# EAGLE schematic Robotics_Cape (EAGLE 7.7.0)
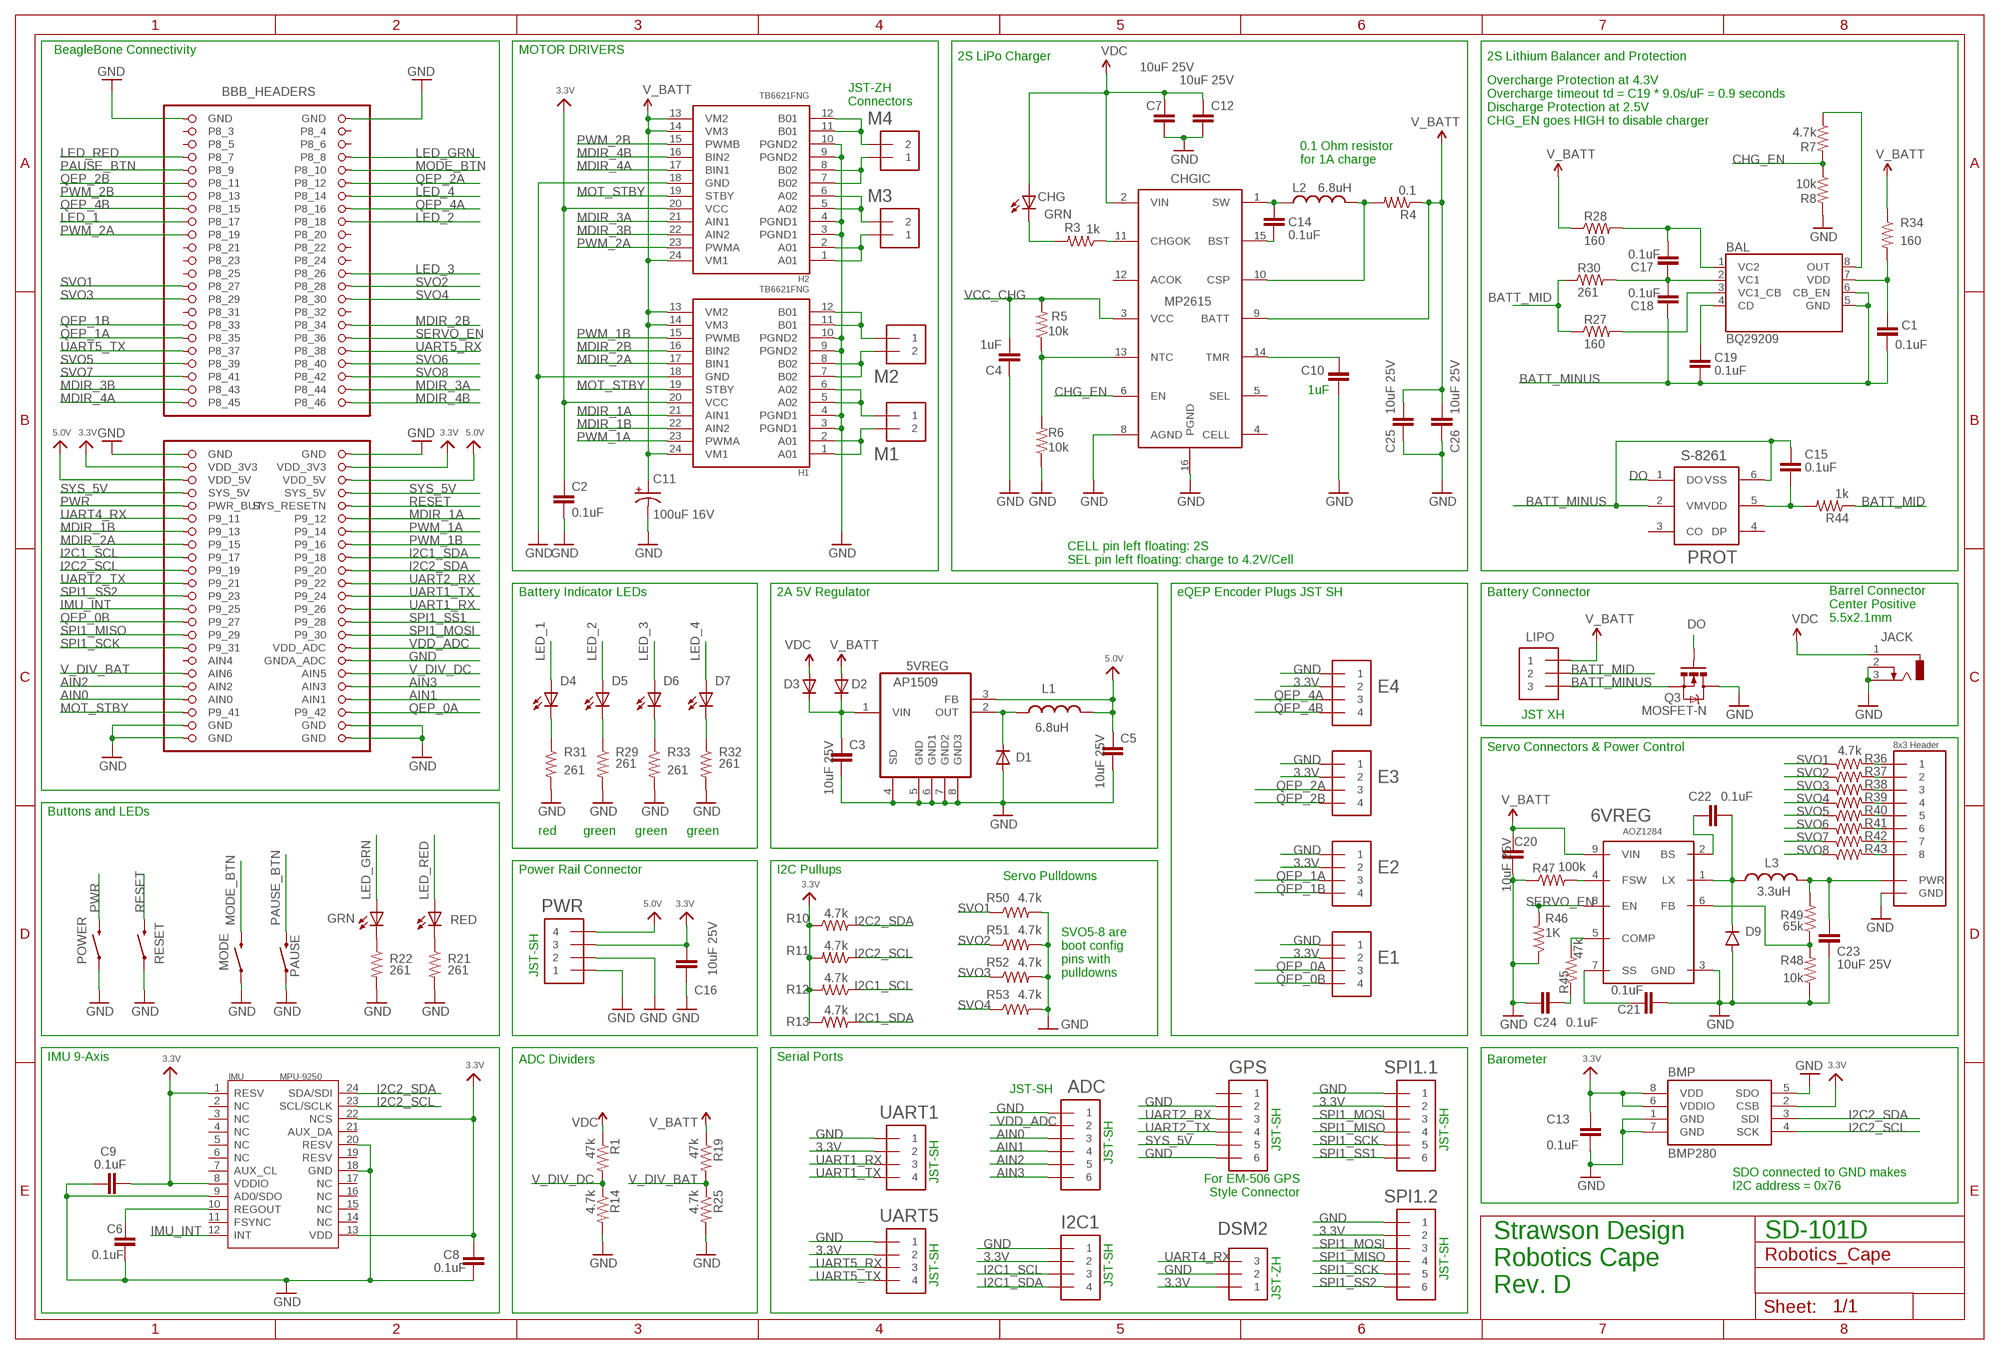
[diagram p0: schematic, sheet 1]

## Parts
5VREG  AP1509SOIC-8-TIGHT  [SO08-TIGHT]
6VREG  AOZ1284  [SO08-EXPOSED]
ADC  JST_SH_6  [JST_SH_6]
BAL  BQ29209  [8-SON_3X3MM]
BBB_HEADERS  BEAGLEBONE_OUTLINE  [BEAGLEBONE_SHIELD]
BMP  BMP280  [BMP280]
C1  0.1uF  CAP0402-CAP  [0402-CAP]
C2  0.1uF  CAP0402-CAP  [0402-CAP]
C3  10uF 25V  CAP0805  [0805]
C4  1uF  CAP0402-CAP  [0402-CAP]
C5  10uF 25V  CAP0805  [0805]
C6  0.1uF  CAP0402-CAP  [0402-CAP]
C7  10uF 25V  CAP0805  [0805]
C8  0.1uF  CAP0402-CAP  [0402-CAP]
C9  0.1uF  CAP0402-CAP  [0402-CAP]
C10  1uF  CAP0402-CAP  [0402-CAP]
C11  100uF 16V  CPOL-USD  [PANASONIC_D]
C12  10uF 25V  CAP0805  [0805]
C13  0.1uF  CAP0402-CAP  [0402-CAP]
C14  0.1uF  CAP0402-CAP  [0402-CAP]
C15  0.1uF  CAP0402-CAP  [0402-CAP]
C16  10uF 25V  CAP0805  [0805]
C17  0.1uF  CAP0402-CAP  [0402-CAP]
C18  0.1uF  CAP0402-CAP  [0402-CAP]
C19  0.1uF  CAP0402-CAP  [0402-CAP]
C20  10uF 25V  CAP0805  [0805]
C21  0.1uF  CAP0402-CAP  [0402-CAP]
C22  0.1uF  CAP0402-CAP  [0402-CAP]
C23  10uF 25V  CAP0805  [0805]
C24  0.1uF  CAP0402-CAP  [0402-CAP]
C25  10uF 25V  CAP0805  [0805]
C26  10uF 25V  CAP0805  [0805]
CHG  GRN  LED0603  [LED-0603]
CHGIC  MP2615  [MP2615]
D1  DIODESOD-123  [SOD-123]
D2  DIODESOD-123  [SOD-123]
D3  DIODESOD-123  [SOD-123]
D4  RED  LED0603  [LED-0603]
D5  GREEN  LED0603  [LED-0603]
D6  GREEN  LED0603  [LED-0603]
D7  GREEN  LED0603  [LED-0603]
D9  DIODEDO214AA  [DO-214AA]
DSM2  JST_ZH_3  [JST_ZH_3]
E1  JST_SH_4  [JST_SH_4_SMD]
E2  JST_SH_4  [JST_SH_4_SMD]
E3  JST_SH_4  [JST_SH_4_SMD]
E4  JST_SH_4  [JST_SH_4_SMD]
GPS  JST_SH_6  [JST_SH_6]
GRN  GRN  LED0603  [LED-0603]
H1  TB6621FNG  [SSOP24]
H2  TB6621FNG  [SSOP24]
I2C1  JST_SH_4  [JST_SH_4_SMD]
IMU  MPU-9250  [QFN24G-0.4-3X3MM]
JACK  5.5x2.1mm  DCJ0303  [DCJ0303]
L1  6.8uH  INDUCTORTAIYO_NR-S  [TAIYO_NRS]
L2  6.8uH  INDUCTORTAIYO_NR-S  [TAIYO_NRS]
L3  3.3uH  INDUCTOR  [8X8MM_INDUCTOR]
LIPO  JST_XH_3-PIN  [JST_XH_3-PIN]
M1  JST_ZH_2  [JST_ZH_2]
M2  JST_ZH_2  [JST_ZH_2]
M3  JST_ZH_2  [JST_ZH_2]
M4  JST_ZH_2  [JST_ZH_2]
MODE  SWITCH-MOMENTARY-2-SMD-1101NE  [TACTILE-SWITCH-1101NE]
PAUSE  SWITCH-MOMENTARY-2-SMD-1101NE  [TACTILE-SWITCH-1101NE]
POWER  SWITCH-MOMENTARY-2-SMD-1101NE  [TACTILE-SWITCH-1101NE]
PROT  S-8261  [SOT-236]
PWR  JST_SH_4  [JST_SH_4_SMD]
Q3  MOSFET-N  MOSFET-NCHANNEL  [SO08-TIGHT]
R1  47k  RESISTOR0402-RES  [0402-RES]
R3  1k  RESISTOR0402-RES  [0402-RES]
R4  0.1  RESISTOR0603  [0603-RES]
R5  10k  RESISTOR0402-RES  [0402-RES]
R6  10k  RESISTOR0402-RES  [0402-RES]
R7  4.7k  RESISTOR0402-RES  [0402-RES]
R8  10k  RESISTOR0402-RES  [0402-RES]
R10  4.7k  RESISTOR0402-RES  [0402-RES]
R11  4.7k  RESISTOR0402-RES  [0402-RES]
R12  4.7k  RESISTOR0402-RES  [0402-RES]
R13  4.7k  RESISTOR0402-RES  [0402-RES]
R14  4.7k  RESISTOR0402-RES  [0402-RES]
R19  47k  RESISTOR0402-RES  [0402-RES]
R21  261  RESISTOR0402-RES  [0402-RES]
R22  261  RESISTOR0402-RES  [0402-RES]
R25  4.7k  RESISTOR0402-RES  [0402-RES]
R27  160  RESISTOR0402-RES  [0402-RES]
R28  160  RESISTOR0402-RES  [0402-RES]
R29  261  RESISTOR0402-RES  [0402-RES]
R30  261  RESISTOR0402-RES  [0402-RES]
R31  261  RESISTOR0402-RES  [0402-RES]
R32  261  RESISTOR0402-RES  [0402-RES]
R33  261  RESISTOR0402-RES  [0402-RES]
R34  160  RESISTOR0402-RES  [0402-RES]
R36  4.7k  RESISTOR0402-RES  [0402-RES]
R37  4.7k  RESISTOR0402-RES  [0402-RES]
R38  4.7k  RESISTOR0402-RES  [0402-RES]
R39  4.7k  RESISTOR0402-RES  [0402-RES]
R40  4.7k  RESISTOR0402-RES  [0402-RES]
R41  4.7k  RESISTOR0402-RES  [0402-RES]
R42  4.7k  RESISTOR0402-RES  [0402-RES]
R43  4.7k  RESISTOR0402-RES  [0402-RES]
R44  1k  RESISTOR0402-RES  [0402-RES]
R45  47k  RESISTOR0402-RES  [0402-RES]
R46  1K  RESISTOR0402-RES  [0402-RES]
R47  100k  RESISTOR0402-RES  [0402-RES]
R48  10k  RESISTOR0402-RES  [0402-RES]
R49  65k  RESISTOR0402-RES  [0402-RES]
R50  4.7k  RESISTOR0402-RES  [0402-RES]
R51  4.7k  RESISTOR0402-RES  [0402-RES]
R52  4.7k  RESISTOR0402-RES  [0402-RES]
R53  4.7k  RESISTOR0402-RES  [0402-RES]
RED  RED  LED0603  [LED-0603]
RESET  SWITCH-MOMENTARY-2-SMD-1101NE  [TACTILE-SWITCH-1101NE]
SPI1.1  JST_SH_6  [JST_SH_6]
SPI1.2  JST_SH_6  [JST_SH_6]
U$1  SERVO_HEADERS_8X  [3X8_0.1"_HEADER]
UART1  JST_SH_4  [JST_SH_4_SMD]
UART5  JST_SH_4  [JST_SH_4_SMD]

## Nets
3.3V: BBB_HEADERS.49(VDD_3V3) BBB_HEADERS.50(VDD_3V3) BMP.2(CSB) BMP.6(VDDIO) BMP.8(VDD) C2.2 C8.1 C9.2 C13.1 C16.1 DSM2.P$1 E1.2 E2.2 E3.2 E4.2 H1.20(VCC) H2.20(VCC) I2C1.2 IMU.1(RESV) IMU.8(VDDIO) IMU.13(VDD) IMU.22(NCS) PWR.3 R10.1 R11.2 R12.2 R13.1 SPI1.1.2 SPI1.2.2 UART1.2 UART5.2
5.0V: 5VREG.3(FB) BBB_HEADERS.51(VDD_5V) BBB_HEADERS.52(VDD_5V) C5.1 L1.2 PWR.4
AIN0: ADC.3 BBB_HEADERS.85(AIN0)
AIN1: ADC.4 BBB_HEADERS.86(AIN1)
AIN2: ADC.5 BBB_HEADERS.83(AIN2)
AIN3: ADC.6 BBB_HEADERS.84(AIN3)
BATT_MID: LIPO.P$2 R27.1 R30.1 R44.1
BATT_MINUS: BAL.5(GND) BAL.6(CB_EN) C1.2 C15.1 C18.1 C19.2 LIPO.P$3 PROT.2(VM) PROT.6(VSS) Q3.1(S) Q3.2(S) Q3.3(S)
CHG_EN: CHGIC.6(EN) R7.2 R8.1
CO: BAL.8(OUT) R7.1
DO: PROT.1(DO) Q3.4(G)
GND: 5VREG.4(SD) 5VREG.5(GND) 5VREG.6(GND1) 5VREG.7(GND2) 5VREG.8(GND3) 6VREG.3(GND) ADC.1 BBB_HEADERS.1(GND) BBB_HEADERS.2(GND) BBB_HEADERS.47(GND) BBB_HEADERS.48(GND) BBB_HEADERS.80(GNDA_ADC) BBB_HEADERS.89(GND) BBB_HEADERS.90(GND) BBB_HEADERS.91(GND) BBB_HEADERS.92(GND) BMP.1(GND) BMP.5(SDO) BMP.7(GND) C2.1 C3.2 C4.1 C5.2 C6.2 C7.2 C8.2 C9.1 C10.1 C11.- C12.2 C13.2 C16.2 C20.1 C21.1 C23.1 C24.1 C25.2 C26.2 CHGIC.8(AGND) CHGIC.16(PGND) D1.A D9.A DSM2.P$2 E1.1 E2.1 E3.1 E4.1 GPS.2 GPS.6 H1.3(PGND1) H1.4(PGND1) H1.9(PGND2) H1.10(PGND2) H1.18(GND) H2.3(PGND1) H2.4(PGND1) H2.9(PGND2) H2.10(PGND2) H2.18(GND) I2C1.1 IMU.9(AD0/SDO) IMU.18(GND) IMU.20(RESV) JACK.2 JACK.3 MODE.P$1 PAUSE.P$1 POWER.P$1 PWR.1 PWR.2 Q3.5(D) Q3.6(D) Q3.7(D) Q3.8(D) R6.1 R8.2 R14.2 R21.2 R22.2 R25.2 R29.2 R31.2 R32.2 R33.2 R46.1 R47.1 R48.1 R50.2 R51.2 R52.2 R53.2 RESET.P$1 SPI1.1.1 SPI1.2.1 U$1.P$13(GND) U$1.P$14(GND) U$1.P$15(GND) U$1.P$16(GND) U$1.P$17(GND) U$1.P$18(GND) U$1.P$23(GND) U$1.P$24(GND) UART1.1 UART5.1
I2C1_SCL: BBB_HEADERS.63(P9_17) I2C1.3 R12.1
I2C1_SDA: BBB_HEADERS.64(P9_18) I2C1.4 R13.2
I2C2_SCL: BBB_HEADERS.65(P9_19) BMP.4(SCK) IMU.23(SCL/SCLK) R11.1
I2C2_SDA: BBB_HEADERS.66(P9_20) BMP.3(SDI) IMU.24(SDA/SDI) R10.2
IMU_INT: BBB_HEADERS.71(P9_25) IMU.12(INT)
L3: D6.C R33.1
L4: D7.C R32.1
LED_1: BBB_HEADERS.17(P8_17) D4.A
LED_2: BBB_HEADERS.18(P8_18) D5.A
LED_3: BBB_HEADERS.26(P8_26) D6.A
LED_4: BBB_HEADERS.14(P8_14) D7.A
LED_GRN: BBB_HEADERS.8(P8_8) GRN.A
LED_RED: BBB_HEADERS.7(P8_7) RED.A
MDIR_1A: BBB_HEADERS.58(P9_12) H1.21(AIN1)
MDIR_1B: BBB_HEADERS.59(P9_13) H1.22(AIN2)
MDIR_2A: BBB_HEADERS.61(P9_15) H1.17(BIN1)
MDIR_2B: BBB_HEADERS.34(P8_34) H1.16(BIN2)
MDIR_3A: BBB_HEADERS.44(P8_44) H2.21(AIN1)
MDIR_3B: BBB_HEADERS.43(P8_43) H2.22(AIN2)
MDIR_4A: BBB_HEADERS.45(P8_45) H2.17(BIN1)
MDIR_4B: BBB_HEADERS.46(P8_46) H2.16(BIN2)
MODE_BTN: BBB_HEADERS.10(P8_10) MODE.P$2
MOT1A: H1.1(A01) H1.2(A01) M1.P$2
MOT1B: H1.5(A02) H1.6(A02) M1.P$1
MOT2A: H1.11(B01) H1.12(B01) M2.P$1
MOT2B: H1.7(B02) H1.8(B02) M2.P$2
MOT3A: H2.1(A01) H2.2(A01) M3.P$1
MOT3B: H2.5(A02) H2.6(A02) M3.P$2
MOT4A: H2.11(B01) H2.12(B01) M4.P$2
MOT4B: H2.7(B02) H2.8(B02) M4.P$1
MOT_STBY: BBB_HEADERS.87(P9_41) H1.19(STBY) H2.19(STBY)
N$1: R36.2 U$1.P$1
N$3: GRN.C R22.1
N$4: BAL.2(VC1) C17.1 C18.2 R30.2
N$6: R21.1 RED.C
N$8: BAL.1(VC2) C17.2 R28.2
N$10: 6VREG.7(SS) C21.2
N$11: C15.2 PROT.5(VDD) R44.2
N$14: C6.1 IMU.10(REGOUT)
N$15: C14.1 CHGIC.15(BST)
N$16: 5VREG.2(OUT) D1.C L1.1
N$17: CHG.C R3.2
N$18: CHGIC.11(CHGOK) R3.1
N$24: BAL.4(CD) C19.1
N$25: R37.2 U$1.P$2
N$29: BAL.7(VDD) C1.1 R34.2
N$30: R38.2 U$1.P$3
N$38: R39.2 U$1.P$4
N$48: D5.C R29.1
N$49: D4.C R31.1
N$50: BAL.3(VC1_CB) R27.2
N$51: R40.2 U$1.P$5
N$52: R41.2 U$1.P$6
N$53: 6VREG.2(BS) C22.1
N$54: R42.2 U$1.P$19
N$55: C14.2 CHGIC.1(SW) L2.1
N$56: R43.2 U$1.P$20
N$60: 6VREG.1(LX) C22.2 D9.C L3.1
N$61: 6VREG.4(FSW) R47.2
N$62: C23.2 L3.2 R49.2 U$1.P$7(PWR) U$1.P$8(PWR) U$1.P$9(PWR) U$1.P$10(PWR) U$1.P$11(PWR) U$1.P$12(PWR) U$1.P$21(PWR) U$1.P$22(PWR)
N$63: 6VREG.5(COMP) R45.2
N$65: 6VREG.6(FB) R48.2 R49.1
N$66: C24.2 R45.1
N$67: CHGIC.10(CSP) L2.2 R4.2
N$69: C10.2 CHGIC.14(TMR)
N$71: CHGIC.13(NTC) R5.1 R6.2
N$79: 5VREG.1(VIN) C3.1 D2.C D3.C
PAUSE_BTN: BBB_HEADERS.9(P8_9) PAUSE.P$2
PWM_1A: BBB_HEADERS.60(P9_14) H1.23(PWMA)
PWM_1B: BBB_HEADERS.62(P9_16) H1.15(PWMB)
PWM_2A: BBB_HEADERS.19(P8_19) H2.23(PWMA)
PWM_2B: BBB_HEADERS.13(P8_13) H2.15(PWMB)
PWR: BBB_HEADERS.55(PWR_BUT) POWER.P$2
QEP_0A: BBB_HEADERS.88(P9_42) E1.3
QEP_0B: BBB_HEADERS.73(P9_27) E1.4
QEP_1A: BBB_HEADERS.35(P8_35) E2.3
QEP_1B: BBB_HEADERS.33(P8_33) E2.4
QEP_2A: BBB_HEADERS.12(P8_12) E3.3
QEP_2B: BBB_HEADERS.11(P8_11) E3.4
QEP_4A: BBB_HEADERS.16(P8_16) E4.3
QEP_4B: BBB_HEADERS.15(P8_15) E4.4
RESET: BBB_HEADERS.56(SYS_RESETN) RESET.P$2
SERVO_EN: 6VREG.8(EN) BBB_HEADERS.36(P8_36) R46.2
SPI1_MISO: BBB_HEADERS.75(P9_29) SPI1.1.4 SPI1.2.4
SPI1_MOSI: BBB_HEADERS.76(P9_30) SPI1.1.3 SPI1.2.3
SPI1_SCK: BBB_HEADERS.77(P9_31) SPI1.1.5 SPI1.2.5
SPI1_SS1: BBB_HEADERS.74(P9_28) SPI1.1.6
SPI1_SS2: BBB_HEADERS.69(P9_23) SPI1.2.6
SVO1: BBB_HEADERS.27(P8_27) R36.1 R50.1
SVO2: BBB_HEADERS.28(P8_28) R37.1 R51.1
SVO3: BBB_HEADERS.29(P8_29) R38.1 R52.1
SVO4: BBB_HEADERS.30(P8_30) R39.1 R53.1
SVO5: BBB_HEADERS.39(P8_39) R40.1
SVO6: BBB_HEADERS.40(P8_40) R41.1
SVO7: BBB_HEADERS.41(P8_41) R42.1
SVO8: BBB_HEADERS.42(P8_42) R43.1
SYS_5V: BBB_HEADERS.53(SYS_5V) BBB_HEADERS.54(SYS_5V) GPS.5
UART1_RX: BBB_HEADERS.72(P9_26) UART1.3
UART1_TX: BBB_HEADERS.70(P9_24) UART1.4
UART2_RX: BBB_HEADERS.68(P9_22) GPS.3
UART2_TX: BBB_HEADERS.67(P9_21) GPS.4
UART4_RX: BBB_HEADERS.57(P9_11) DSM2.P$3
UART5_RX: BBB_HEADERS.38(P8_38) UART5.3
UART5_TX: BBB_HEADERS.37(P8_37) UART5.4
V_BATT: 6VREG.9(VIN) C11.+ C20.2 C25.1 C26.1 CHGIC.9(BATT) D2.A H1.13(VM2) H1.14(VM3) H1.24(VM1) H2.13(VM2) H2.14(VM3) H2.24(VM1) LIPO.P$1 R4.1 R19.1 R28.1 R34.1
V_DIV_BAT: BBB_HEADERS.81(AIN6) R19.2 R25.1
V_DIV_DC: BBB_HEADERS.82(AIN5) R1.2 R14.1
VCC: C7.1 C12.1 CHG.A CHGIC.2(VIN) D3.A JACK.1 R1.1 ; supply symbol labelled VDC
VCC_CHG: C4.2 CHGIC.3(VCC) R5.2
VDD_ADC: ADC.2 BBB_HEADERS.78(VDD_ADC)
Unconnected: BBB_HEADERS.3(P8_3) BBB_HEADERS.4(P8_4) BBB_HEADERS.5(P8_5) BBB_HEADERS.6(P8_6) BBB_HEADERS.20(P8_20) BBB_HEADERS.21(P8_21) BBB_HEADERS.22(P8_22) BBB_HEADERS.23(P8_23) BBB_HEADERS.24(P8_24) BBB_HEADERS.25(P8_25) BBB_HEADERS.31(P8_31) BBB_HEADERS.32(P8_32) BBB_HEADERS.79(AIN4) CHGIC.4(CELL) CHGIC.5(SEL) CHGIC.12(ACOK) GPS.1 IMU.2(NC) IMU.3(NC) IMU.4(NC) IMU.5(NC) IMU.6(NC) IMU.7(AUX_CL) IMU.11(FSYNC) IMU.14(NC) IMU.15(NC) IMU.16(NC) IMU.17(NC) IMU.19(RESV) IMU.21(AUX_DA) PROT.3(CO) PROT.4(DP)

## Notes on the sheet
- BeagleBone Connectivity | MOTOR DRIVERS
- 2S LiPo Charger | 2S Lithium Balancer and Protection
- JST-ZH
  Connectors
- Overcharge Protection at 4.3V
  Overcharge timeout td = C19 * 9.0s/uF = 0.9 seconds
  Discharge Protection at 2.5V
  CHG_EN goes HIGH to disable charger
- 0.1 Ohm resistor
  for 1A charge
- CELL pin left floating: 2S
  SEL pin left floating: charge to 4.2V/Cell
- Battery Indicator LEDs | 2A 5V Regulator | eQEP Encoder Plugs JST SH | Battery Connector
- Barrel Connector
  Center Positive
  5.5x2.1mm
- JST XH
- Servo Connectors & Power Control
- Buttons and LEDs
- red | green | green | green
- Power Rail Connector | I2C Pullups
- Servo Pulldowns
- JST-SH
- SVO5-8 are
  boot config
  pins with
  pulldowns
- ADC Dividers | Barometer
- IMU 9-Axis | Serial Ports
- JST-SH
- JST-SH | JST-SH
- JST-SH
- JST-SH
- SDO connected to GND makes
  I2C address = 0x76
- For EM-506 GPS
  Style Connector
- SD-101D
- JST-SH
- JST-SH | JST-SH
- Strawson Design
  Robotics Cape
  Rev. D
- JST-ZH

## Library data of the parts
5VREG = Strawson_Eagle_Lib:AP1509: 150KHz, 2A PWM BUCK DC/DC CONVERTER
6VREG = Strawson_Eagle_Lib:AOZ1284
ADC GPS SPI1.1 SPI1.2 = Strawson_Eagle_Lib:JST_SH_6
BAL = Strawson_Eagle_Lib:BQ29209: BQ29209 2-CELL Balance and Overvoltage Protection
BBB_HEADERS = Strawson_Eagle_Lib:BEAGLEBONE_OUTLINE: Should match A3 pinout - but not completely tested
BMP = Strawson_Eagle_Lib:BMP280: BOSCH BMP280 Digital Pressure Sensor
C1 C2 C4 C6 C8-C10 C13-C15 C17-C19 C21 C22 C24 = Strawson_Eagle_Lib:CAP: Capacitor Standard 0603 ceramic capacitor, and 0.1" leaded capacitor.
C3 C5 C7 C12 C16 C20 C23 C25 C26 = SparkFun-Capacitors:CAP: Capacitor Standard 0603 ceramic capacitor, and 0.1" leaded capacitor.
C11 = adafruit:CPOL-US: POLARIZED CAPACITOR, American symbol
CHG D4-D7 GRN RED = SparkFun-LED:LED: LEDs Standard schematic elements and footprints for 5mm, 3mm, 1206, and 0603 sized LEDs. 5mm - Spark Fun Electronics SKU : COM-00529 (and others)
CHGIC = Strawson_Eagle_Lib:MP2615
D1-D3 = adafruit:DIODE: Diode
D9 = Strawson_Eagle_Lib:DIODE: Diode
DSM2 = Strawson_Eagle_Lib:JST_ZH_3
E1-E4 I2C1 PWR UART1 UART5 = Strawson_Eagle_Lib:JST_SH_4
H1 H2 = SparkFun:TB6621FNG: Toshiba 1A motor driver
IMU = Strawson_Eagle_Lib:MPU-9250: 314990005; MPN: MPU-9250
JACK = Strawson_Eagle_Lib:DCJ0303: DC POWER JACK Source: DCJ0303.pdf; OC_FARNELL: unknown; OC_NEWARK: unknown
L1 L2 = Strawson_Eagle_Lib:INDUCTOR: Inductors Basic Inductor/Choke - 0603 and 1206. Footprints are not proven and vary greatly between part numbers. SRN6045- 33uH, 20% 1.4A SDR0403-560KL - 56uH, 10%, 500mA RMS/740mA peak; PROD_ID: NDUC-11627
L3 = Strawson_Eagle_Lib:INDUCTOR: Inductors Basic Inductor/Choke - 0603 and 1206. Footprints are not proven and vary greatly between part numbers. SRN6045- 33uH, 20% 1.4A SDR0403-560KL - 56uH, 10%, 500mA RMS/740mA peak
LIPO = Strawson_Eagle_Lib:JST_XH_3-PIN
M1-M4 = Strawson_Eagle_Lib:JST_ZH_2
MODE PAUSE POWER RESET = SparkFun-Electromechanical:SWITCH-MOMENTARY-2: Various NO switches- pushbuttons, reed, etc
PROT = Strawson_Eagle_Lib:S-8261
Q3 = Strawson_Eagle_Lib:MOSFET-NCHANNEL: Common NMOSFET Parts MFG P/N Store ID Prod ID FDD8780 TRANS-09984 SI7820DN TRANS-11055 FDS6630A IC-08089 2N7002PW TRANS-11151 FQP30N06L COM-10213 TRANS-10060 BSS123LT1G TRANS-08345 BSS138 TRANS-00830 BS170 2N7000
R1 R3 R5-R8 R10-R14 R19 R21 R22 R25 R27-R34 R36-R53 = Strawson_Eagle_Lib:RESISTOR: Resistor Basic schematic elements and footprints for 0603, 1206, and PTH resistors.
R4 = SparkFun-Resistors:RESISTOR: Resistor Basic schematic elements and footprints for 0603, 1206, and PTH resistors.
U$1 = Strawson_Eagle_Lib:SERVO_HEADERS_8X